# EAGLE design MyLiPoV31 (EAGLE 5.11)
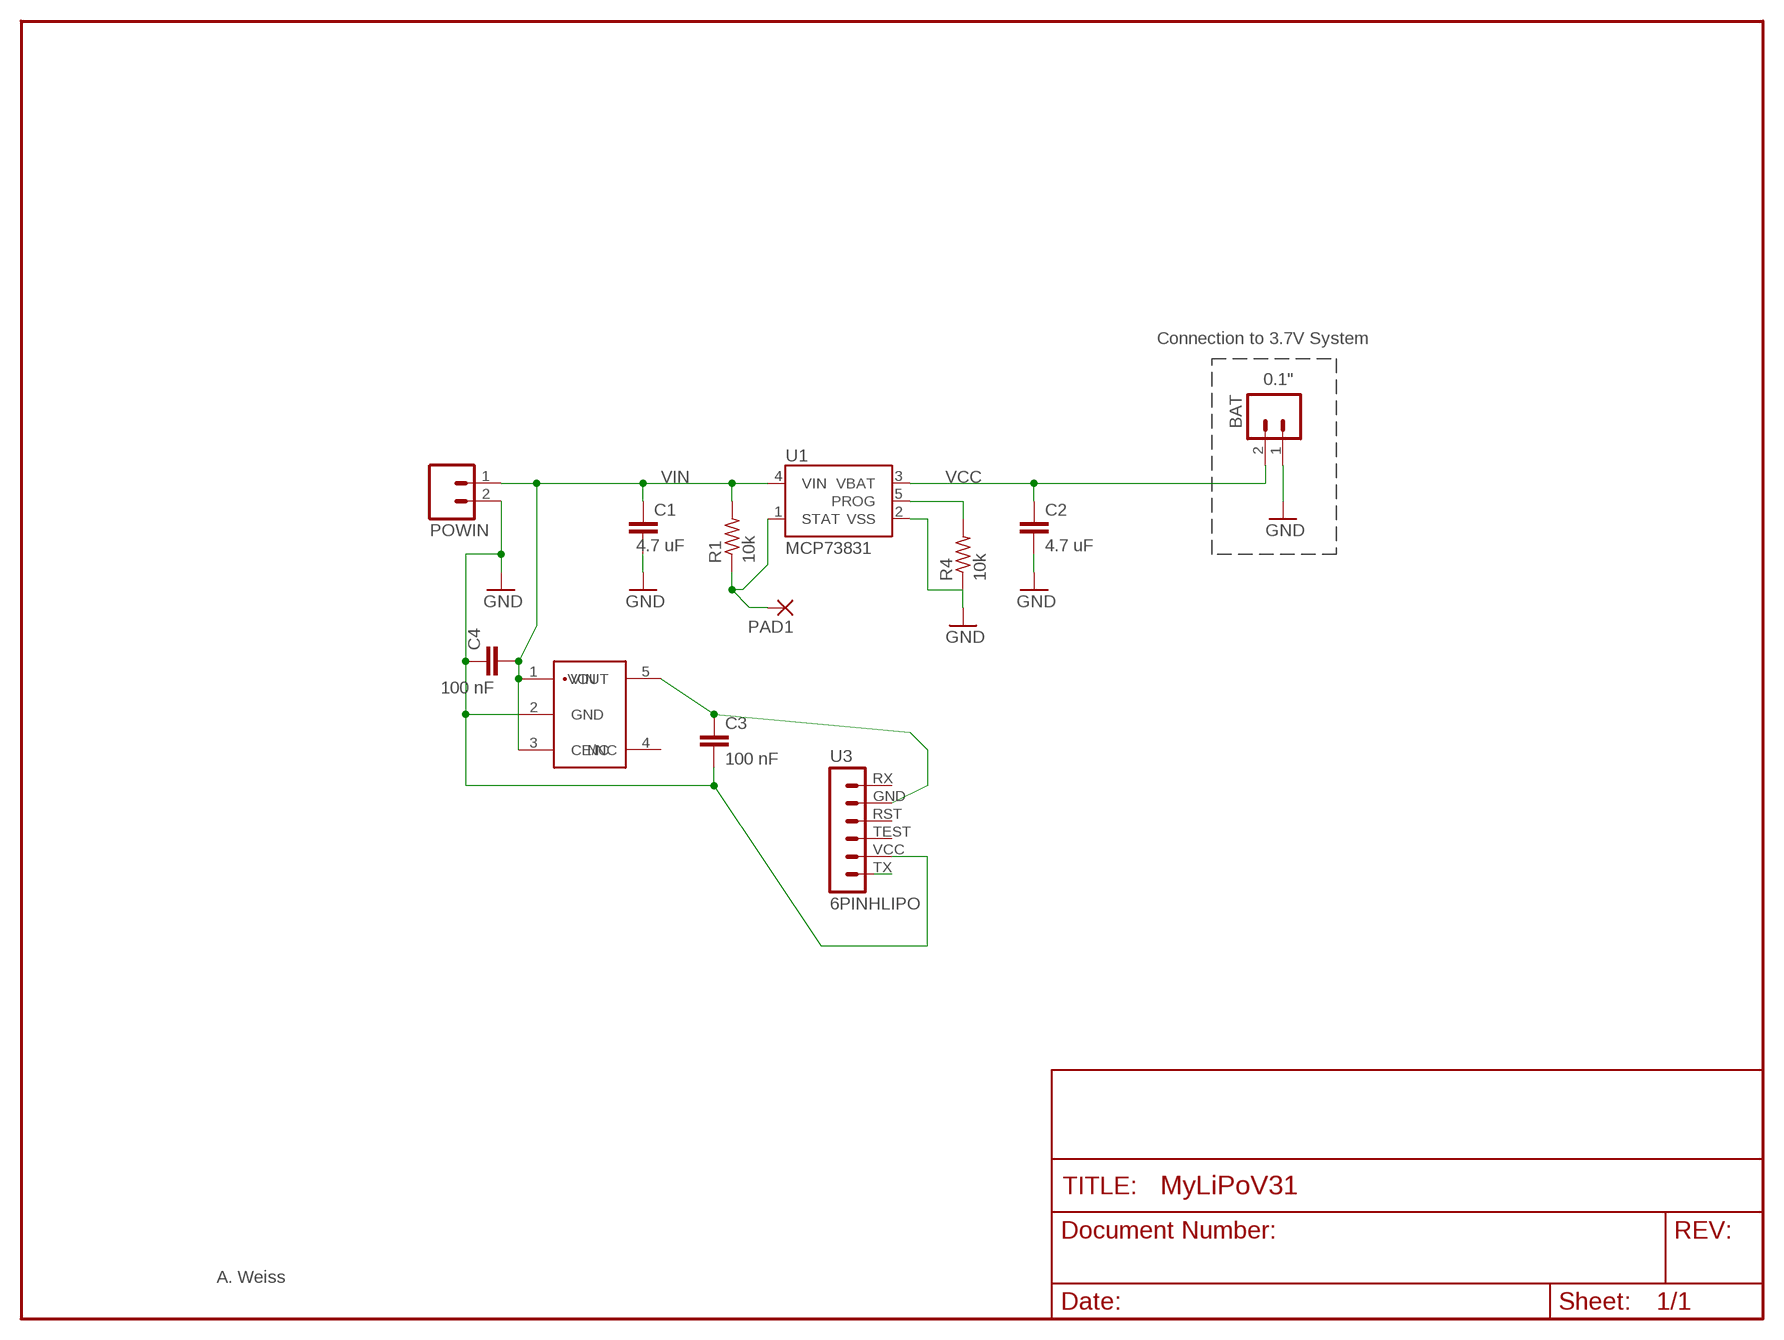
[diagram p0: schematic, sheet 1]

## Parts
BAT  M02PTH  [1X02]
C1  4.7 uF  C-EUC0805K  [C0805K]
C2  4.7 uF  C-EUC0805K  [C0805K]
C3  100 nF  C-EUC0805K  [C0805K]
C4  100 nF  C-EUC0805K  [C0805K]
PAD1  1,6/0,8  [1,6/0,8]
POWIN  M02PTH  [1X02]
R1  10k  R-US_R0603  [R0603]
R4  10k  R-US_R0603  [R0603]
U1  MCP73831  [SOT23-5]
U2  NCP4682UDFN4  [SOT23-5]
U3  6PINHLIPO  [MALEHEADER]

## Nets
GND: BAT.1 C1.2 C2.2 C3.2 C4.1 POWIN.2 R4.1 U1.2(VSS) U2.2(GND) U3.VCC
N$1: C3.1 U2.5(VOUT) U3.GND
N$2: PAD1.1(P) R1.1 U1.1(STAT)
N$3: U3.TX
PROG: R4.2 U1.5(PROG)
VCC: BAT.2 C2.1 U1.3(VBAT)
VIN: C1.1 C4.2 POWIN.1 R1.2 U1.4(VIN) U2.1(VIN) U2.3(CE/NC)
Unconnected: U2.4(NC) U3.RST U3.RX U3.TEST

## Notes on the sheet
- Connection to 3.7V System
- 0.1"
- A. Weiss

## Library data of the parts
BAT POWIN = SparkFun:M02: Header 2 Standard 2-pin 0.1" header. Use with straight break away headers (SKU : PRT-00116), right angle break away headers (PRT-00553), swiss pins (PRT-00743), machine pins (PRT-00117), and female headers (PRT-00115). Molex polarized connector foot print use with SKU : PRT-08233 with associated crimp pins and housings.
C1-C4 = resistor:C-EU: CAPACITOR, European symbol
PAD1 = wirepad:1,6/0,8: THROUGH-HOLE PAD
R1 R4 = resistor:R-US_: RESISTOR, American symbol
U1 = SparkFun:MCP73831: Microchip's MCP73831 Miniature single cell, fully integrated Li-Ion, Li-polymer charge management controller http://ww1.microchip.com/downloads/en/DeviceDoc/21984a.pdf
U2 = lipo:NCP4682: NCP4682 3.3 volt regulator
U3 = lipo:6PINH: 6PINH 6 pin header for lipo board, 0.050 mil (1.27 mm) pitch

## Board
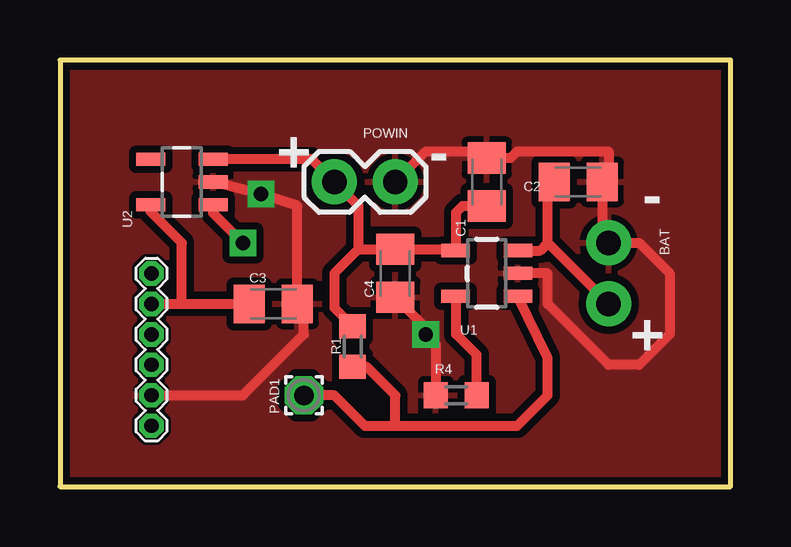
[diagram p1: board, top side]
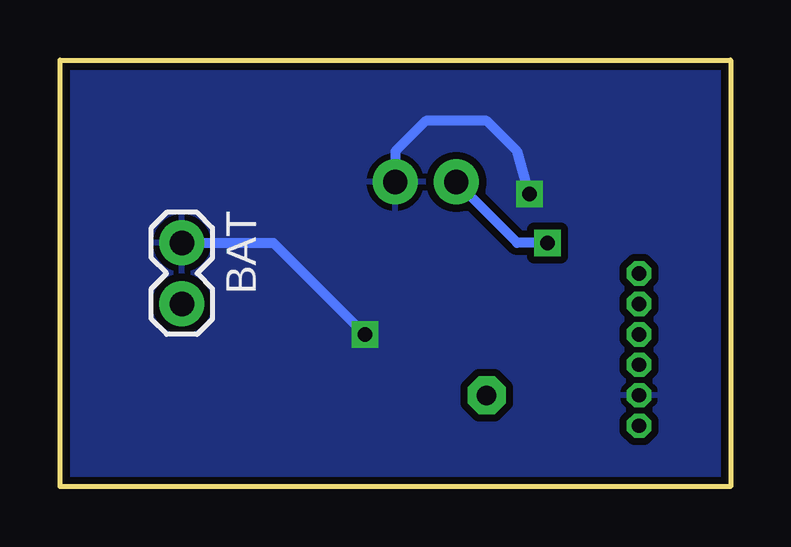
[diagram p2: board, bottom side, seen from below]

Size 27.94 x 17.78 mm. Coordinates in mm from the lower left corner, seen from the top.
Outline: 27.94,0 27.94,17.78 0,17.78 0,0 27.94,0
Copper layers (1*16): Top 0.035mm / dielectric 1.5mm / Bottom 0.035mm
Design rules "SparkFun *": minimum track width 8mil, minimum drill 20mil, track to track 8mil, track to pad 8mil, pad to pad 8mil, via to via 8mil, smd to smd 8mil, copper to edge 10mil, drill to drill 8mil, minimum pad ring 4mil, minimum via ring 10mil, stop-mask expansion 4mil, vias tented up to drill 25mil, thermal gap 10mil

### Footprints (pad centres in the part's own frame; a part is rotated, then mirrored left to right if it is on the bottom)
1X02 = drill 1.016 pad 1.88 round: 1 0,0; 2 2.54,0
C0805K = smd 1.3 x 1.6: 1 -1,0; 2 1,0
1,6/0,8 = drill 0.813 pad 1.6 octagon: 1 0,0
R0603 = smd 1 x 1.1: 1 -0.85,0; 2 0.85,0
SOT23-5 = smd 0.55 x 1.2: 1 -0.95,-1.3; 2 0,-1.3; 3 0.95,-1.3; 4 0.95,1.3; 5 -0.95,1.3
MALEHEADER = drill 0.6 pad 1.016 octagon: GND 2.54,0; RST 1.27,0; RX 3.81,0; TEST 0,0; TX -2.54,0; VCC -1.27,0

### Placement (x,y rotation side)
BAT  22.86,10.16 270 bottom
C1  17.78,12.7 90 top
C2  21.59,12.7 0 top
C3  8.89,7.62 0 top
C4  13.97,8.89 90 top
PAD1  10.16,3.81 90 top
POWIN  11.43,12.7 0 top
R1  12.19,5.84 90 top
R4  16.51,3.81 0 top
U1  17.78,8.89 90 top
U2  5.08,12.7 90 top
U3  3.81,5.08 90 top

### Tracks (layer width: path | path; a pad name or v marks a point on that pad's centre or on a via)
GND  (via drill 0.6)
  Top 0.406: POWIN.2 15.24,13.97 17.51,13.97 C1.2 18.78,13.7 19.05,13.97 22.86,13.97 22.86,12.97 C2.2 22.59,10.43 BAT.1 24.13,10.16 25.4,8.89 25.4,6.35 24.13,5.08 22.86,5.08 20.32,7.62 20.32,8.89 U1.2 | C4.1 15.24,6.62 v15.24,6.35 15.66,5.93 R4.1 | U2.2 v8.38,12.19 9.89,11.7 C3.2 10.16,7.35 10.16,6.35 7.62,3.81 U3.VCC
  Bottom 0.406: BAT.1 19.05,10.16 v15.24,6.35 | v8.38,12.19 8.89,13.97 10.16,15.24 12.7,15.24 13.97,13.97 POWIN.2
  pour Bottom (isolate 0.305): 0,0 0,17.78 27.94,17.78 27.94,0
  pour Top (isolate 0.305): 0,17.78 27.94,17.78 27.94,0 0,0
N$1
  Top 0.406: U2.5 3.78,11.46 5.08,10.16 5.08,7.62 U3.GND C3.1
N$2
  Top 0.406: U1.1 20.32,5.37 20.32,3.81 19.05,2.54 13.97,2.54 | R1.1 12.79,4.99 13.97,3.81 13.97,2.54 | 13.97,2.54 12.7,2.54 11.43,3.81 PAD1.1
PROG
  Top 0.406: R4.2 17.36,5.5 16.51,6.35 16.51,7.91 U1.5
VCC
  Top 0.406: U1.3 20,9.84 20.32,10.16 | 20.32,10.16 20.32,12.43 C2.1 | 20.32,10.16 BAT.2
VIN  (via drill 0.6)
  Top 0.406: C1.1 16.78,11.7 16.51,11.43 16.51,9.87 U1.4 16.43,9.89 C4.2 12.43,9.89 | 12.43,9.89 11.43,8.89 11.43,7.45 R1.2 | U2.3 10.48,13.65 POWIN.1 12.43,11.7 12.43,9.89 | U2.1 6.38,11.4 v7.62,10.16
  Bottom 0.406: v7.62,10.16 8.89,10.16 POWIN.1

### Text on the board
tPlace: + | - | - | BAT | +